# Altium schematic sheet Schematic.SchDoc
size A
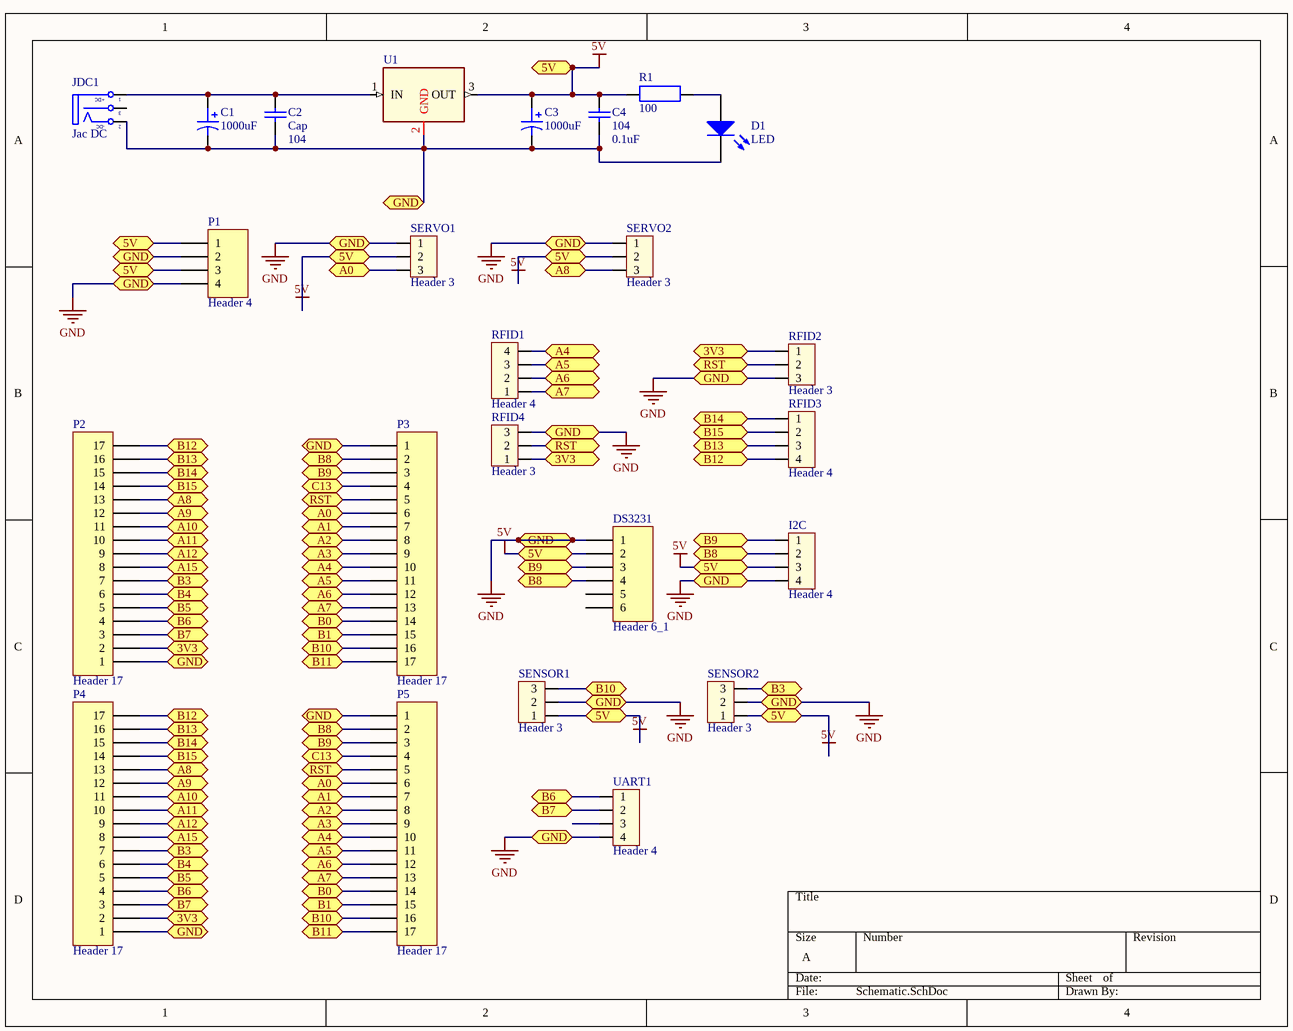
[diagram p0: Schematic.SchDoc]

## Parts
C1  value 1000uF  [RADIAL C]  (hidden comment: Cap Pol)
C2  Cap  value 104  [C3MM]
C3  value 1000uF  [RADIAL C]  (hidden comment: Cap Pol)
C4  104  value 0.1uF  [C3MM]
D1  LED  [LED-0 5mm BLUE]
DS3231  Header 6_1  [HDR1X6]
I2C  Header 4  [HED4]
JDC1  Jac DC  [DC-IN]
P1  Header 4  [Header 4]
P2  Header 17  [HDR1X17]
P3  Header 17  [HDR1X17]
P4  Header 17  [HDR1X17]
P5  Header 17  [HDR1X17]
R1  100  [R1W]
RFID1  Header 4  [HED4]
RFID2  Header 3  [HED3]
RFID3  Header 4  [HED4]
RFID4  Header 3  [HED3]
SENSOR1  Header 3  [HED3]
SENSOR2  Header 3  [HED3]
SERVO1  Header 3  [HED3]
SERVO2  Header 3  [HED3]
U1  LM78xx  [TO-220]  (value not drawn)
UART1  Header 4  [HED4]

## Ports
3V3, 5V, A0, A1, A2, A3, A4, A5, A6, A7, A8, A9, A10, A11, A12, A15, B0, B1, B3, B4, B5, B6, B7, B8, B9, B10, B11, B12, B13, B14, B15, C13, GND, RST

## Nets
5V: C3.1 C4.2 DS3231.2 I2C.3 P1.1 P1.3 R1.1 SENSOR1.1 SENSOR2.1 SERVO1.2 SERVO2.2 U1.3(OUT) ; port 5V
GND: C1.2 C2.1 C3.2 C4.1 D1.2(K) DS3231.1 I2C.4 JDC1.2(TN) P1.2 P1.4 P2.1 P3.1 P4.1 P5.1 RFID2.3 RFID4.3 SENSOR1.2 SENSOR2.2 SERVO1.1 SERVO2.1 U1.2(GND) UART1.4 ; port GND
3V3: P2.2 P4.2 RFID2.1 RFID4.1 ; port 3V3
A0: P3.6 P5.6 SERVO1.3 ; port A0
A1: P3.7 P5.7 ; port A1
A2: P3.8 P5.8 ; port A2
A3: P3.9 P5.9 ; port A3
A4: P3.10 P5.10 RFID1.4 ; port A4
A5: P3.11 P5.11 RFID1.3 ; port A5
A6: P3.12 P5.12 RFID1.2 ; port A6
A7: P3.13 P5.13 RFID1.1 ; port A7
A8: P2.13 P4.13 SERVO2.3 ; port A8
A9: P2.12 P4.12 ; port A9
A10: P2.11 P4.11 ; port A10
A11: P2.10 P4.10 ; port A11
A12: P2.9 P4.9 ; port A12
A15: P2.8 P4.8 ; port A15
B0: P3.14 P5.14 ; port B0
B1: P3.15 P5.15 ; port B1
B3: P2.7 P4.7 SENSOR2.3 ; port B3
B4: P2.6 P4.6 ; port B4
B5: P2.5 P4.5 ; port B5
B6: P2.4 P4.4 UART1.1 ; port B6
B7: P2.3 P4.3 UART1.2 ; port B7
B8: DS3231.4 I2C.2 P3.2 P5.2 ; port B8
B9: DS3231.3 I2C.1 P3.3 P5.3 ; port B9
B10: P3.16 P5.16 SENSOR1.3 ; port B10
B11: P3.17 P5.17 ; port B11
B12: P2.17 P4.17 RFID3.4 ; port B12
B13: P2.16 P4.16 RFID3.3 ; port B13
B14: P2.15 P4.15 RFID3.1 ; port B14
B15: P2.14 P4.14 RFID3.2 ; port B15
C13: P3.4 P5.4 ; port C13
RST: P3.5 P5.5 RFID2.2 RFID4.2 ; port RST
NetC1_1: C1.1 C2.2 JDC1.1(T) U1.1(IN)
NetD1_1: D1.1(A) R1.2

Not connected (* = marked no-connect by the designer): DS3231 5 6; JDC1 3(S); UART1 3

## Notes on the sheet
- (in symbol DCIN) +DC; -DC

## Library data of the parts
C1 C3 = Cap Pol: Polarized Capacitor; Published: 8-Jun-2000; LatestRevisionDate: 17-Jul-2002; LatestRevisionNote: Re-released for DXP Platform.; PackageReference: POLAR0.8; Publisher: Altium Limited
C2 C4 = Cap: Capacitor; Published: 8-Jun-2000; LatestRevisionDate: 17-Jul-2002; LatestRevisionNote: Re-released for DXP Platform.; PackageReference: RAD-0.3; Publisher: Altium Limited
D1 = LED: Typical LED; Published: 8-Jun-2000; LatestRevisionDate: 08-Jul-2005; LatestRevisionNote: Mech Layer 1 removed.; PackageReference: LED-1; Publisher: Altium Limited
DS3231 = Header 6_1: Header, 6-Pin; LatestRevisionDate: 17-Jul-2002; LatestRevisionNote: Re-released for DXP Platform.; Publisher: Altium Limited
I2C RFID1 RFID3 UART1 = Hed4: Header 4 (Green); Value: Header 4
JDC1 = DCIN: Jac DC input; Value: Jac DC
P1 = Header 4: Header, 4-Pin; LatestRevisionDate: 17-Jul-2002; LatestRevisionNote: Re-released for DXP Platform.; Publisher: Altium Limited
P2-P5 = Header 17: Header, 17-Pin; LatestRevisionDate: 17-Jul-2002; LatestRevisionNote: Re-released for DXP Platform.; Publisher: Altium Limited
R1 = R1W: Resistor 1W; Value: R1W - 100
RFID2 RFID4 SENSOR1 SENSOR2 SERVO1 SERVO2 = Hed3: Header 3 (Green); Value: Header 3
U1 = LM78xx: Regulator; Manufacturer: Fairchild Semiconductor Corporation; PSpiceTemplate: X^@REFDES %IN %OUT %GND @MODEL; Vendor: Digikey; Output Current: Up to 1A; V out: 5V; Tolerance: 4 %; Value: LM7805CT; Published: 13-April-2009; Publisher: Hoang Nguyen; ComponentLink1Description: Digikey Part Link; ComponentLink2Description: Open Datasheet; ComponentLink2URL: H:\LIBRARY\LIBRARY.Datasheet\LM7805.pdf; Price: 2500 VND